# EAGLE schematic PCB Potencia con IC (EAGLE 9.6.2)
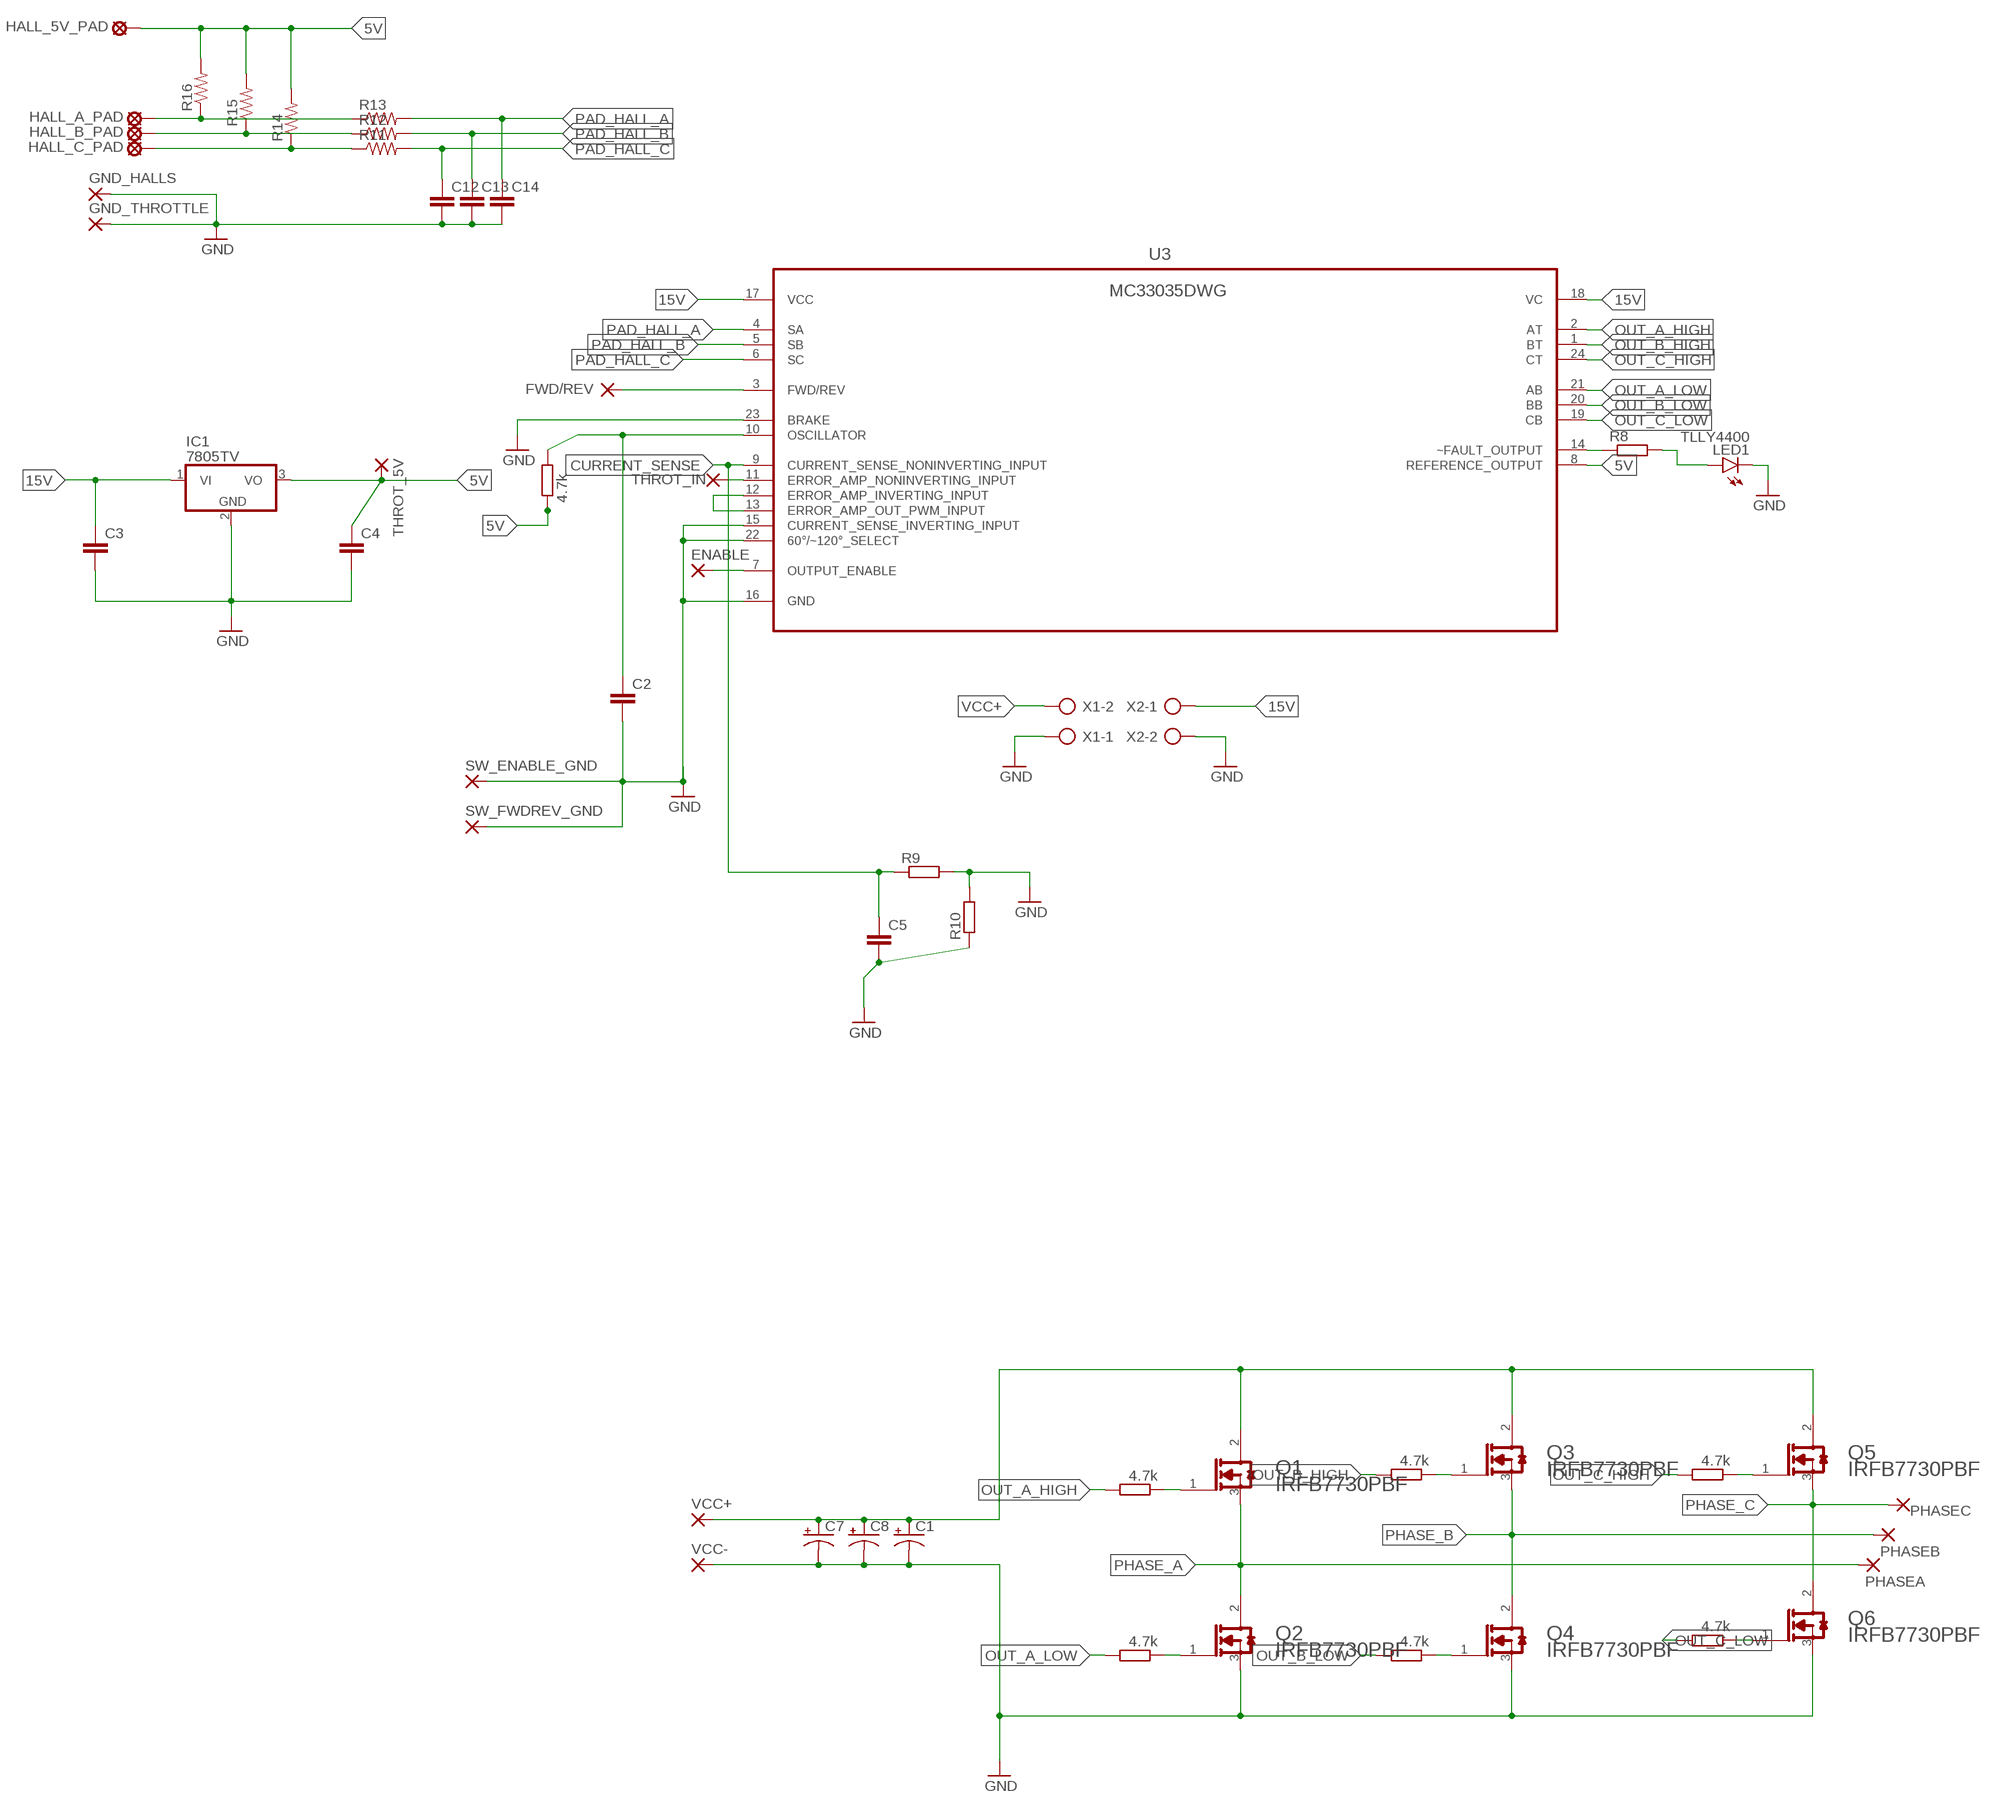
[diagram p0: schematic, sheet 1]

## Parts
C1  CPOL-USTT5D11  [TT5D11]
C2  C-EU025-030X050  [C025-030X050]
C3  C-EU025-030X050  [C025-030X050]
C4  C-EU025-030X050  [C025-030X050]
C5  C-EU025-030X050  [C025-030X050]
C7  CPOL-USTT5D11  [TT5D11]
C8  CPOL-USTT5D11  [TT5D11]
C12  C-EU025-030X050  [C025-030X050]
C13  C-EU025-030X050  [C025-030X050]
C14  C-EU025-030X050  [C025-030X050]
ENABLE  3,81/1,1  [3,81/1,1]
FWD/REV  3,81/1,4  [3,81/1,4]
GND_HALLS  3,81/1,1  [3,81/1,1]
GND_THROTTLE  3,81/1,1  [3,81/1,1]
HALL_5V_PAD  MCS08  [MCS08]
HALL_A_PAD  MCS08  [MCS08]
HALL_B_PAD  MCS08  [MCS08]
HALL_C_PAD  MCS08  [MCS08]
IC1  7805TV  [TO220V]
LED1  TLLY4400  [LED3MM]
PHASEA  3,81/1,4  [3,81/1,4]
PHASEB  3,81/1,4  [3,81/1,4]
PHASEC  3,81/1,4  [3,81/1,4]
Q1  INFINEON_IRFB7730PBFINFINEON_IRFB7730PBF_0_0  [INFINEON_IRFB7730PBF_0]
Q2  INFINEON_IRFB7730PBFINFINEON_IRFB7730PBF_0_0  [INFINEON_IRFB7730PBF_0]
Q3  INFINEON_IRFB7730PBFINFINEON_IRFB7730PBF_0_0  [INFINEON_IRFB7730PBF_0]
Q4  INFINEON_IRFB7730PBFINFINEON_IRFB7730PBF_0_0  [INFINEON_IRFB7730PBF_0]
Q5  INFINEON_IRFB7730PBFINFINEON_IRFB7730PBF_0_0  [INFINEON_IRFB7730PBF_0]
Q6  INFINEON_IRFB7730PBFINFINEON_IRFB7730PBF_0_0  [INFINEON_IRFB7730PBF_0]
R1  4.7k  R-EU_0207/10  [0207/10]
R2  4.7k  R-EU_0207/10  [0207/10]
R3  4.7k  R-EU_0207/10  [0207/10]
R4  4.7k  R-EU_0207/10  [0207/10]
R5  4.7k  R-EU_0207/10  [0207/10]
R6  4.7k  R-EU_0207/10  [0207/10]
R7  4.7k  R-EU_0207/10  [0207/10]
R8  R-EU_0207/10  [0207/10]
R9  R-EU_0207/10  [0207/10]
R10  R-EU_0207/10  [0207/10]
R11  R-US_0204/7  [0204/7]
R12  R-US_0204/7  [0204/7]
R13  R-US_0204/7  [0204/7]
R14  R-US_0204/7  [0204/7]
R15  R-US_0204/7  [0204/7]
R16  R-US_0204/7  [0204/7]
SW_ENABLE_GND  3,81/1,4  [3,81/1,4]
SW_FWDREV_GND  3,81/1,4  [3,81/1,4]
THROT_5V  3,81/1,4  [3,81/1,4]
THROT_IN  3,81/1,4  [3,81/1,4]
U3  MC33035DWG  [SOIC127P1030X265-24N]
VCC+  3,81/1,4  [3,81/1,4]
VCC-  3,81/1,4  [3,81/1,4]
X1  AK500/2-H  [AK500/2-H]
X2  AK500/2-H  [AK500/2-H]

## Nets
5V: C4.1 HALL_5V_PAD.MP IC1.3(VO) R7.1 R14.2 R15.2 R16.2 THROT_5V.1(P) U3.8(REFERENCE_OUTPUT)
15V: U3.17(VCC) U3.18(VC) X2.1
CURRENT_SENSE: C5.1 R9.1 U3.9(CURRENT_SENSE_NONINVERTING_INPUT)
GND: C1.- C2.2 C3.2 C4.2 C5.2 C7.- C8.- C12.2 C13.2 C14.2 GND_HALLS.1(P) GND_THROTTLE.1(P) IC1.2(GND) LED1.K(C) Q2.3(S) Q4.3(S) Q6.3(S) R9.2 R10.1 R10.2 SW_ENABLE_GND.1(P) SW_FWDREV_GND.1(P) U3.15(CURRENT_SENSE_INVERTING_INPUT) U3.16(GND) U3.22(60°/~120°_SELECT) U3.23(BRAKE) VCC-.1(P) X1.1 X2.2
N$1: C1.+ C7.+ C8.+ Q1.2(D) Q3.2(D) Q5.2(D) VCC+.1(P)
N$2: Q1.1(G) R1.1
N$3: FWD/REV.1(P) U3.3(FWD/REV)
N$4: ENABLE.1(P) U3.7(OUTPUT_ENABLE)
N$6: Q2.1(G) R2.1
N$7: Q3.1(G) R3.1
N$8: Q4.1(G) R4.1
N$9: Q5.1(G) R5.1
N$10: Q6.1(G) R6.1
N$11: U3.12(ERROR_AMP_INVERTING_INPUT) U3.13(ERROR_AMP_OUT_PWM_INPUT)
N$19: C3.1 IC1.1(VI)
N$20: R8.1 U3.14(~FAULT_OUTPUT)
N$21: THROT_IN.1(P) U3.11(ERROR_AMP_NONINVERTING_INPUT)
N$24: C2.1 R7.2 U3.10(OSCILLATOR)
N$25: LED1.A R8.2
N$29: HALL_A_PAD.MP R13.1 R16.1
N$32: HALL_B_PAD.MP R12.1 R15.1
N$33: HALL_C_PAD.MP R11.1 R14.1
OUT_A_HIGH: R1.2 U3.2(AT)
OUT_A_LOW: R2.2 U3.21(AB)
OUT_B_HIGH: R3.2 U3.1(BT)
OUT_B_LOW: R4.2 U3.20(BB)
OUT_C_HIGH: R5.2 U3.24(CT)
OUT_C_LOW: R6.2 U3.19(CB)
PAD_HALL_A: C14.1 R13.2 U3.4(SA)
PAD_HALL_B: C13.1 R12.2 U3.5(SB)
PAD_HALL_C: C12.1 R11.2 U3.6(SC)
PHASE_A: PHASEA.1(P) Q1.3(S) Q2.2(D)
PHASE_B: PHASEB.1(P) Q3.3(S) Q4.2(D)
PHASE_C: PHASEC.1(P) Q5.3(S) Q6.2(D)
VCC+: X1.2

## Library data of the parts
C1 C7 C8 = rcl:CPOL-US: POLARIZED CAPACITOR, American symbol; SPICEPREFIX: C
C2-C5 C12-C14 = rcl:C-EU: CAPACITOR, European symbol; SPICEPREFIX: C
ENABLE GND_HALLS GND_THROTTLE = wirepad:3,81/1,1: THROUGH-HOLE PAD
FWD/REV PHASEA PHASEB PHASEC SW_ENABLE_GND SW_FWDREV_GND THROT_5V THROT_IN VCC+ VCC- = wirepad:3,81/1,4: THROUGH-HOLE PAD
HALL_5V_PAD HALL_A_PAD HALL_B_PAD HALL_C_PAD = solpad:MCS08: SOLDER PAD MC S0,8, drill 1.2 mm, distributor Buerklin, 08F130
IC1 = linear:78*: Positive VOLTAGE REGULATOR Source: http://cache.national.com/ds/LM/LM78L05.pdf http://www.fairchildsemi.com/ds/LM/LM7805.pdf
LED1 = led:TLLY4400: Low Current (2mA) LED 3 mm Tinted Diffused Package color YELLOW Source: Data sheet <http://www.farnell.com/datasheets/391098.pdf>; MF: VISHAY SEMICONDUCTOR; OC_FARNELL: 1612439
Q1-Q6 = Infineon - IRFB7730PBF:INFINEON_IRFB7730PBF: N-Channel 75V 195A (Tc) 375W (Tc) Through Hole TO-220AB; AUTOMOTIVE: No; CENTROID_NOT_SPECIFIED: No; CONTINUOUS_DRAIN_CURRENT: 195A; DATASHEET: https://www.infineon.com/dgdl/irfs7730pbf.pdf?fileId=5546d462533600a40153563aad5921dc; DEPLETION_MODE: False; DEVICE_CLASS_L1: Discrete Semiconductors; DEVICE_CLASS_L2: Transistors; DEVICE_CLASS_L3: MOSFETs; DIGIKEY_DESCRIPTION: MOSFET N-CH 75V 195A TO220; DIGIKEY_PART_NUMBER: IRFB7730PBF-ND; DRAIN_TO_SOURCE_BREAKDOWN_VOLTAGE: 75V; DRAIN_TO_SOURCE_RESISTANCE: 2.2mΩ; DRAIN_TO_SOURCE_VOLTAGE: 75V; FOOTPRINT_PARAMETERS_0: {"fp_type":"TO220","params":{"N":{"long name":"Number of leads","type":"fixed","short name":"N","value":3},"A":{"nom":false,"long name":"Total height","min":15800000,"max":16129999,"short name":"A","type":"measurement"},"A1":{"nom":false,"long name":"Package clearance","min":3370000,"max":3670000,"short name":"A1","type":"measurement"},"D":{"nom":false,"long name":"Package length","min":false,"max":10750000,"short name":"D","type":"measurement"},"E":{"nom":false,"long name":"Package width","min":false,"max":4830000,"short name":"E","type":"measurement"},"B":{"nom":false,"long name":"Lead width","min":610000,"max":940000,"short name":"B","type":"measurement"},"C":{"nom":false,"long name":"Lead thickness","min":330000,"max":630000,"short name":"C","type":"measurement"},"e":{"nom":2540000,"long name":"Lead pitch","min":null,"max":null,"short name":"e","type":"measurement"},"offset x":{"nom":0,"long name":"X Center offset","min":null,"max":null,"short name":"offset x","type":"measurement"},"offset y":{"nom":0,"long name":"Y Center offset","min":null,"max":null,"short name":"offset y","type":"measurement"},"LS":{"default":"Circle","long name":"Land shape","type":"multichoice","short name":"LS"},"LS1":{"default":"Square","long name":"Land shape (Pin 1)","type":"multichoice","short name":"LS1"}}}; FOOTPRINT_URL: https://www.infineon.com/dgdl/po-to220ab-fp.pdf?fileId=5546d462580663ef0158068cfbee01be; FOOTPRINT_VARIANT_NAME_0: Recommended_Land_Pattern; GATE_CHARGE_AT_VGS: 271nC @ 10V; GATE_TO_SOURCE_VOLTAGE: 20V; HEIGHT: 19.8mm; INPUT_CAPACITACE_AT_VDS: 13660pF @ 25V; IPC_LAND_PATTERN_NAME: TO-220; LEAD_FREE: Yes; MAX_FORWARD_DIODE_VOLTAGE: 1.2V; MAX_JUNCTION_TEMP: +175°C; MF: Infineon; MFG_PACKAGE_IDENT: PG-TO220-3; MFG_PACKAGE_IDENT_COMPONENT_ID: 802d71249bb95e7c; MFG_PACKAGE_IDENT_DATE: 02/2008; MFG_PACKAGE_IDENT_REV: 904; MOUSER_PART_NUMBER: 942-IRFB7730PBF; MPN: IRFB7730PBF; NUMBER_OF_CHANNELS: 1; NUMBER_OF_N_CHANNELS: 1; PACKAGE: TO-220AB; POWER_DISSIPATION: 375W; PREFIX: Q; PULSE_DRAIN_CURRENT: 984A; REVERSE_RECOVERY_CHARGE: 70nC; REVERSE_RECOVERY_TIME: 44ns; ROHS: Yes; RTHJA_MAX: 62°C/W; STANDOFF_HEIGHT: 3.37mm; TECHNOLOGY: MOSFET; TEMPERATURE_RANGE_HIGH: +175°C; TEMPERATURE_RANGE_LOW: -55°C; THRESHOLD_VGS: 2.1V; THRESHOLD_VGS_MAX: 3.7V; THRESHOLD_VGS_MIN: 2.1V; TURN_OFF_DELAY_TIME: 180ns; TURN_ON_DELAY_TIME: 21ns; VERIFICATION_VERSION: 0.0.0.3
R1-R10 = rcl:R-EU_: RESISTOR, European symbol; SPICEPREFIX: R
R11-R16 = rcl:R-US_: RESISTOR, American symbol; SPICEPREFIX: R
U3 = MC33035DWG:MC33035DWG: Brushless DC Motor Controller Check availability <https://pricing.snapeda.com/parts/MC33035DWG/ON%20Semiconductor/view-part?ref=eda>; AVAILABILITY: In Stock; DESCRIPTION: - Motor Driver - Analog 24-SOIC; MF: ON Semiconductor; MP: MC33035DWG; PACKAGE: SOIC-24 ON Semiconductor; PRICE: None; PURCHASE-URL: https://pricing.snapeda.com/search/part/MC33035DWG/?ref=eda
X1 X2 = con-ptr500:AK500/2-H: CONNECTOR Aug. 2004 / PTR Meßtechnik: Die Bezeichnung der Serie AK505 wurde geändert. Es handelt sich hierbei um AK500 in horizontaler Ausführung.; OC_FARNELL: unknown; OC_NEWARK: unknown